# EasyEDA Pro project home-connection.eprj

# Schematic Schematic1
Create Date: 2023-07-15; Page Name: P1; Project Name: home-connection; Schematic Name: Schematic1; Update Date: 2024-01-20; Company: 嘉立创EDA; Page Size: A4; Version: V1.0
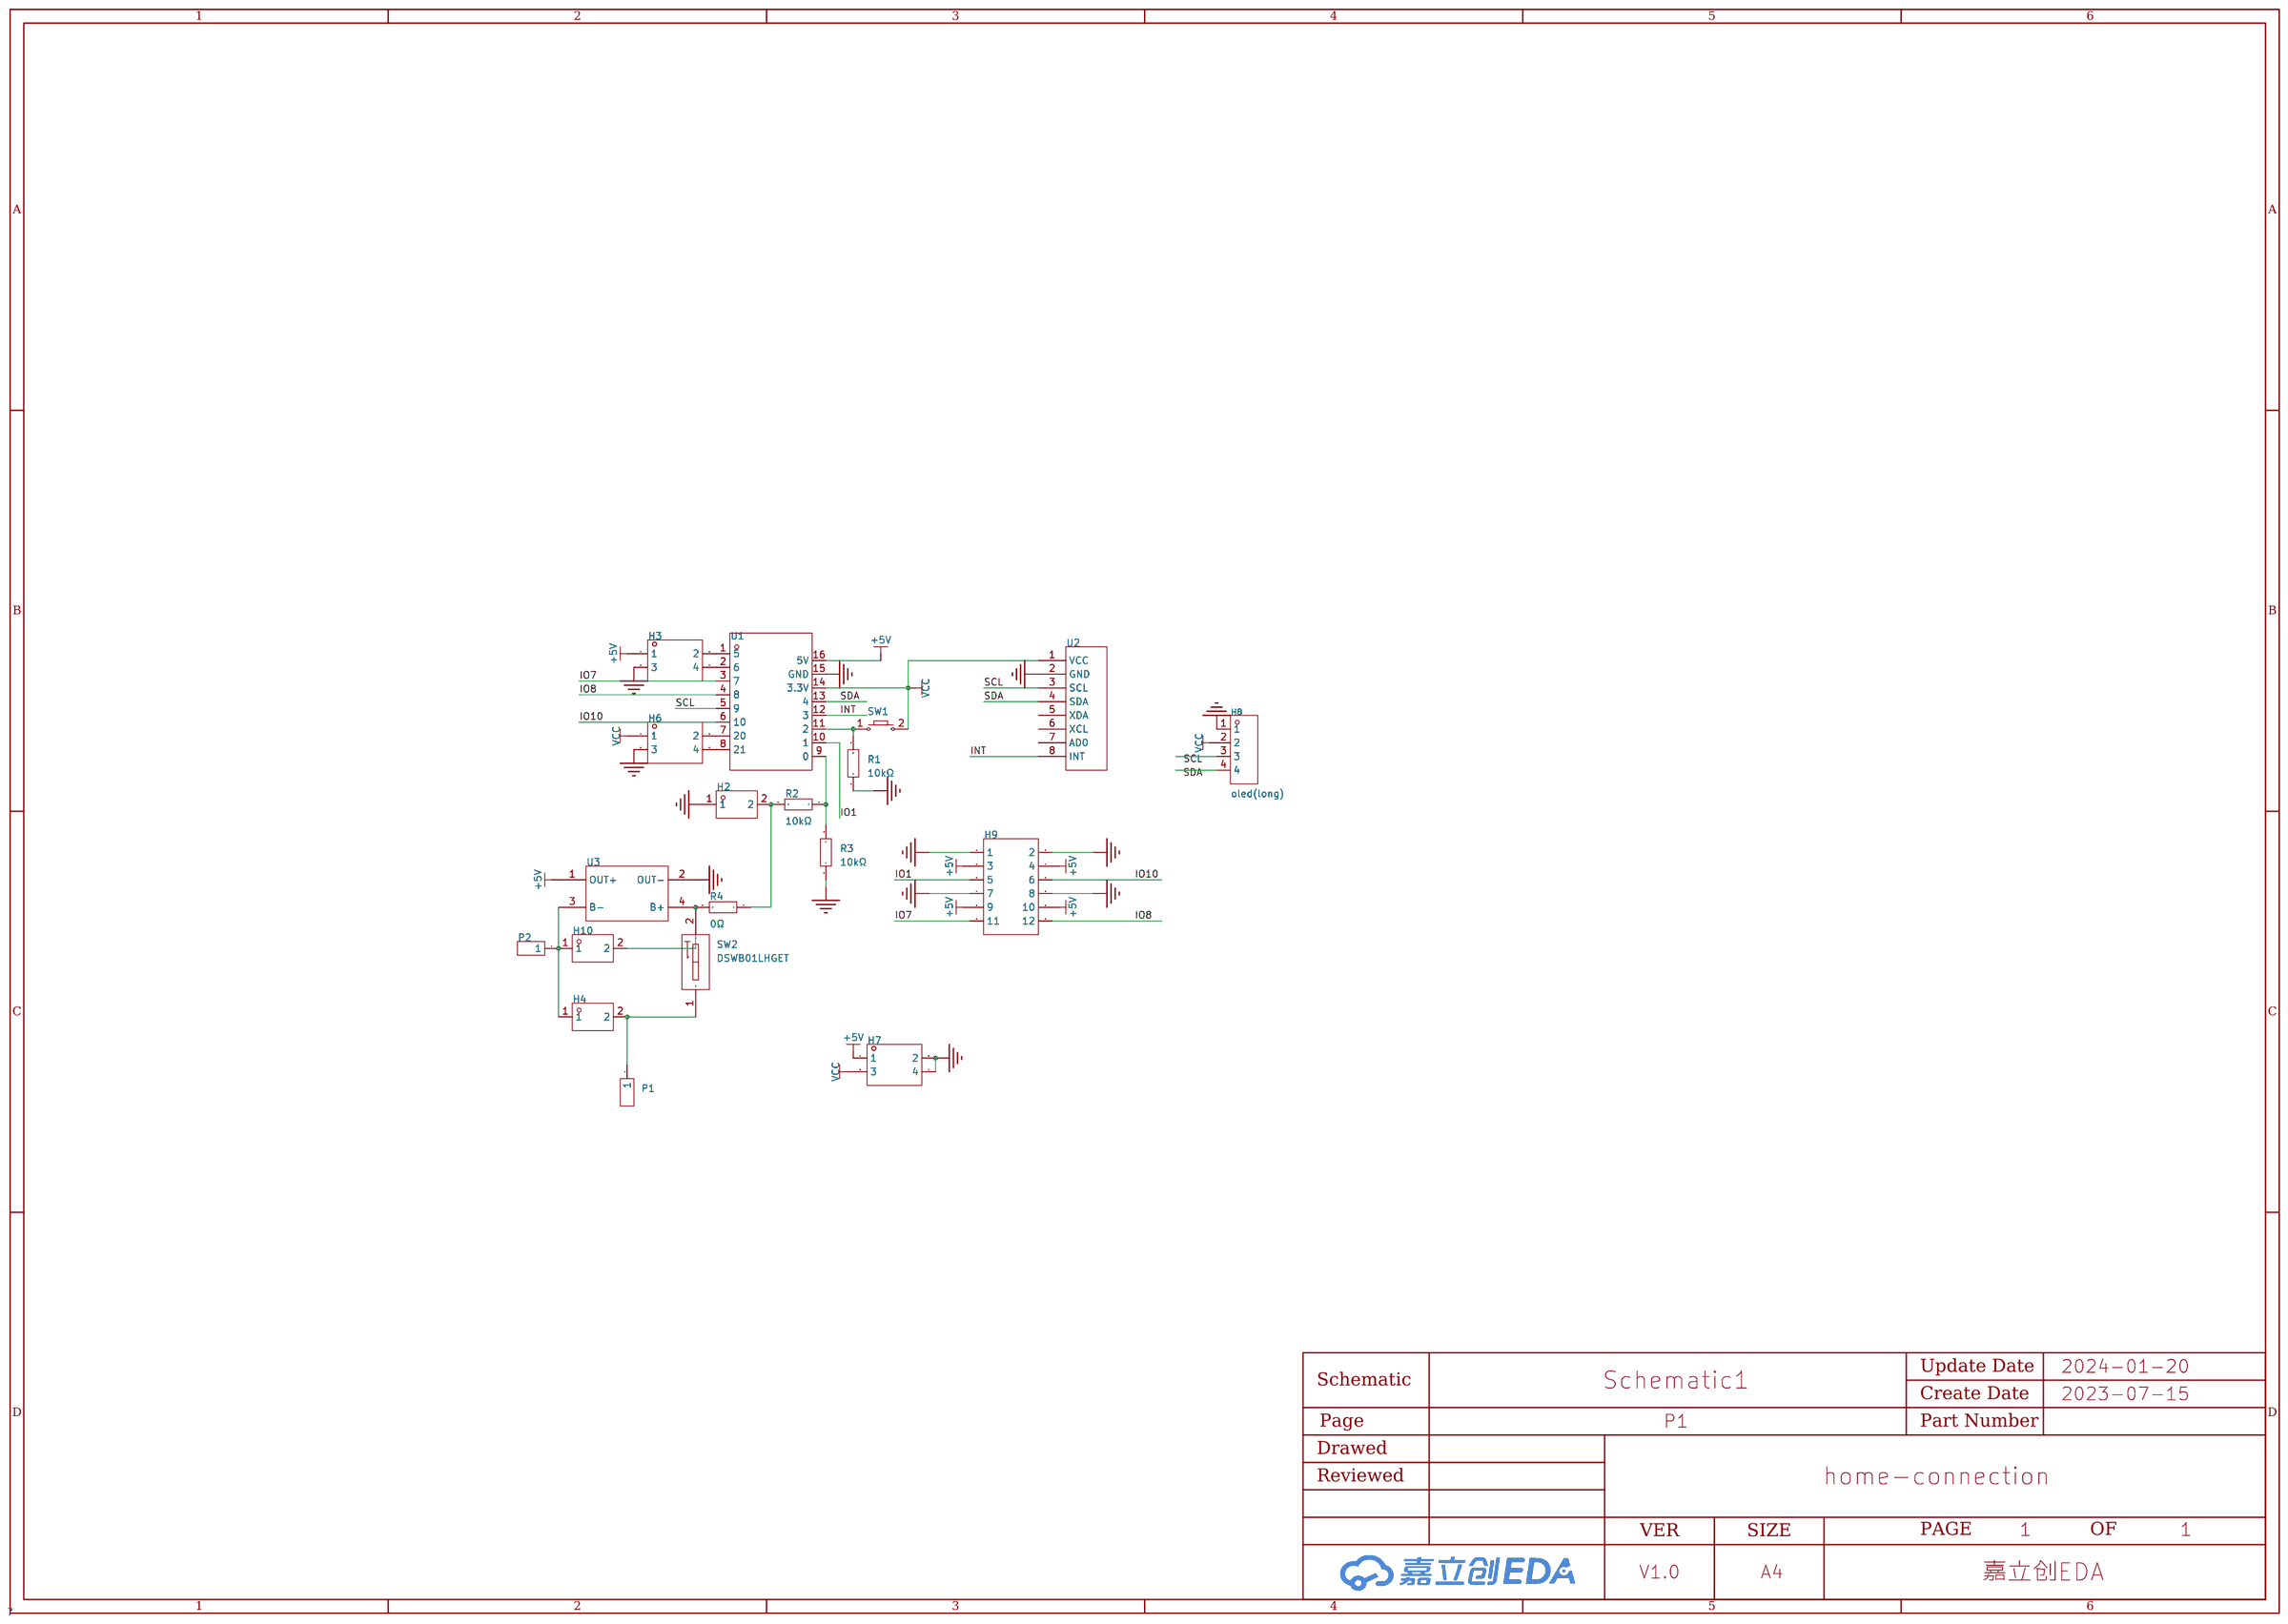
[diagram p0: schematic sheet]

## Parts
H2  -  [HDR-TH_2P-P2.54-V-M-2]
H3  -  [HDR-TH_4P-P2.54-V-F-R2-C2-S2.54]
H4  -  [HDR-TH_2P-P2.54-V-M-2]
H6  -  [HDR-TH_4P-P2.54-V-F-R2-C2-S2.54]
H7  -  [HDR-TH_4P-P2.54-V-F-R2-C2-S2.54]
H8  oled(long)  [HDR-TH_4P-P2.54-V-M]
H9  -  [HDR-TH_12P-P2.54-V-M-R2-C6-S2.54]
H10  -  [HDR-TH_2P-P2.54-V-M-2]
P1  -  [HDR-TH_1P-P2.54-V-M]
P2  -  [HDR-TH_1P-P2.54-V-M]
R1  10kΩ  [R0603]
R2  10kΩ  [R0603]
R3  10kΩ  [R0603]
R4  0Ω  [R0603]
SW1  -  [Key_SMD_3x4x2]
SW2  DSWB01LHGET  [SW-TH_DSWB01LHGET]
U1  2.4GHz  [ESP32-C3-SUPERMINI]
U2  -  [GY-521]
U3  -  [BAT-CHARGE]

## Library data of the parts
H2 H4 H10 = HDR-M_2.54_2x1: Supplier Part: C2883961; Supplier Footprint: 插件,P=2.54mm
H3 H6 H7 = HDR-F_2.54_2x2: Supplier Part: C92273; Supplier Footprint: 插件
H8 = PZ254V-11-04P: 排数:单排;总PIN位数:4;间距:2.54mm;插针结构:1x4P;行距:-;安装类型:直插;圆针/方针:方针;额定电流:3A;额定电压:250V;配合针长度:6mm;塑高:2.5mm;端接针长度:3mm;触头材质:-;工作温度范围:-40℃~+105℃;颜色:黑色;; LCSC Part Name: 2.54mm 1x4P 直插 方针; Supplier Part: C2691448; Manufacturer: XFCN(兴飞); Supplier Footprint: 直插,P=2.54mm; JLCPCB Part Class: Extended Part; Supplier: LCSC; Number of Rows: 单排; Number of Pins: 4; Pitch: 2.54mm; Pin Structure: 1x4P; Mounting Type: 直插; Circluar Pins/Square Pins: 方针; Current Rating (Max): 3A; Voltage Rating (Max): 250V; Length of Mating Pin: 6mm; Insulation Height: 2.5mm; Length of End Connection Pin: 3mm; Operating Temperature Range: -40℃~+105℃; Color: 黑色
H9 = HDR-F_2.54_2x6: Supplier Part: C92270; Supplier Footprint: 插件; JLCPCB Part Class: 扩展库
P1 P2 = 2.54-1*1P针: 间距:-;总PIN位数:1;排数:1;插针结构:-;行距:-;安装类型:直插;圆针/方针:-;额定电流:-;额定电压:-;配合针长度:-;塑高:-;触头材质:-;触头镀层:-;颜色:黑色;; LCSC Part Name: 1x1P; Supplier Part: C81276; Manufacturer: BOOMELE(博穆精密); Supplier Footprint: 插件; JLCPCB Part Class: Extended Part; Supplier: LCSC; Number of Pins: 1; Number of Rows: 1; Mounting Type: 直插; Color: 黑色
R1-R4 = 0603WAF1002T5E: 电阻类型:厚膜电阻;阻值:10kΩ;精度:±1%;功率:100mW;; LCSC Part Name: 厚膜电阻 10kΩ ±1% 100mW; Supplier Part: C25804; Manufacturer: UNI-ROYAL(厚声); Supplier Footprint: 0603; JLCPCB Part Class: Basic Part; Datasheet: https://atta.szlcsc.com/upload/public/pdf/source/20200306/C422600_1E6D84923E4A46A82E41ADD87F860B5C.pdf; Supplier: LCSC; Type: 厚膜电阻; Tolerance: ±1%; Power(Watts): 100mW; Temperature Coefficient: ±100ppm/℃; Overload Voltage (Max): 75V; Operating Temperature Range: -55℃~+155℃
SW1 = Key_SMD_3x4x2: Supplier Footprint: SMD
SW2 = DSWB01LHGET: 类型:平拨,凸起式;电路结构:单刀单掷;开关位数:1;使用寿命:-;颜色:红色;; LCSC Part Name: 红色宽体1位顶拨插件; Supplier Part: C126888; Manufacturer: YE; Supplier Footprint: 插件; JLCPCB Part Class: 扩展库; Datasheet: https://atta.szlcsc.com/upload/public/pdf/source/20170824/C126888_1503565979649906649.pdf; Supplier: LCSC; Type: 平拨,凸起式; Circuit: 单刀单掷; Number of Positions: 1; Color: 红色
U1 = ESP32-C3-SUPERMINI: 核心处理器:ESP32-C3芯片;频率:2.4GHz;发射功率:20.5dBm;; LCSC Part Name: ESP32-C3-WROOM-02U-N4; Supplier Part: C2926676; Manufacturer: ESPRESSIF(乐鑫); Manufacturer Part: ESP32-C3-WROOM-02U-N4; Supplier Footprint: SMD-19P; JLCPCB Part Class: 扩展库; Datasheet: https://atta.szlcsc.com/upload/public/pdf/source/20220106/F07459EFFE1D7CBA94B4FB8A075146A6.pdf; Supplier: LCSC; Core Processor: ESP32-C3芯片; Support Interface: I2C；GPIO；SPI；PWM；JTAG；ADC；UART；USB；I2S; Output Power: 20.5dBm
U2 = GY-521: MPU6050
U3 = BAT-CHARGE: 电池充电模块

## Nets
+5V: H3.1 H7.1 H9.3 H9.4 H9.9 H9.10 U1.16(5V) U3.1(OUT+)
GND: H2.1 H3.3 H6.3 H7.2 H7.4 H8.1 H9.1 H9.2 H9.7 H9.8 R1.1 R3.1 U1.15(GND) U2.2(GND) U3.2(OUT-)
VCC: H6.1 H7.3 H8.2 SW1.2 U1.14(3.3V) U2.1(VCC)
INT: U1.12(3) U2.8(INT)
IO1: H9.5 U1.10(1)
IO7: H9.11 U1.3(7)
IO8: H9.12 U1.4(8)
IO10: H9.6 U1.6(10)
SCL: H8.3 U1.5(9) U2.3(SCL)
SDA: H8.4 U1.13(4) U2.4(SDA)
$1N15091: H3.4 U1.2(6)
$1N15093: H3.2 U1.1(5)
$1N15807: H6.4 U1.8(21)
$1N15809: H6.2 U1.7(20)
$1N16520: H2.2 R2.2 R4.1
$1N16674: R2.1 R3.2 U1.9(0)
$1N16678: H4.2 P1.1 SW2.1(A1)
$1N16682: H4.1 H10.1 P2.1 U3.3(B-)
$1N16689: R1.2 SW1.1 U1.11(2)
$1N17005: H10.2 R4.2 SW2.2 U3.4(B+)

Not connected (* = marked no-connect by the designer): U2 5(XDA) 6(XCL) 7(AD0)

# Board PCB1
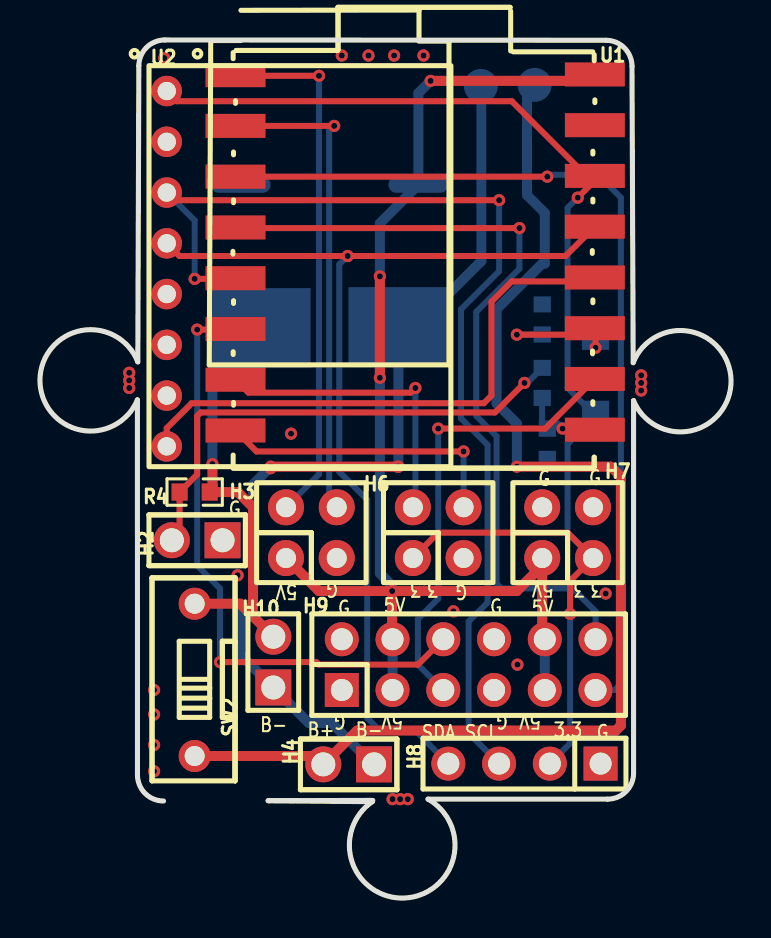
[diagram p1: board, top side]
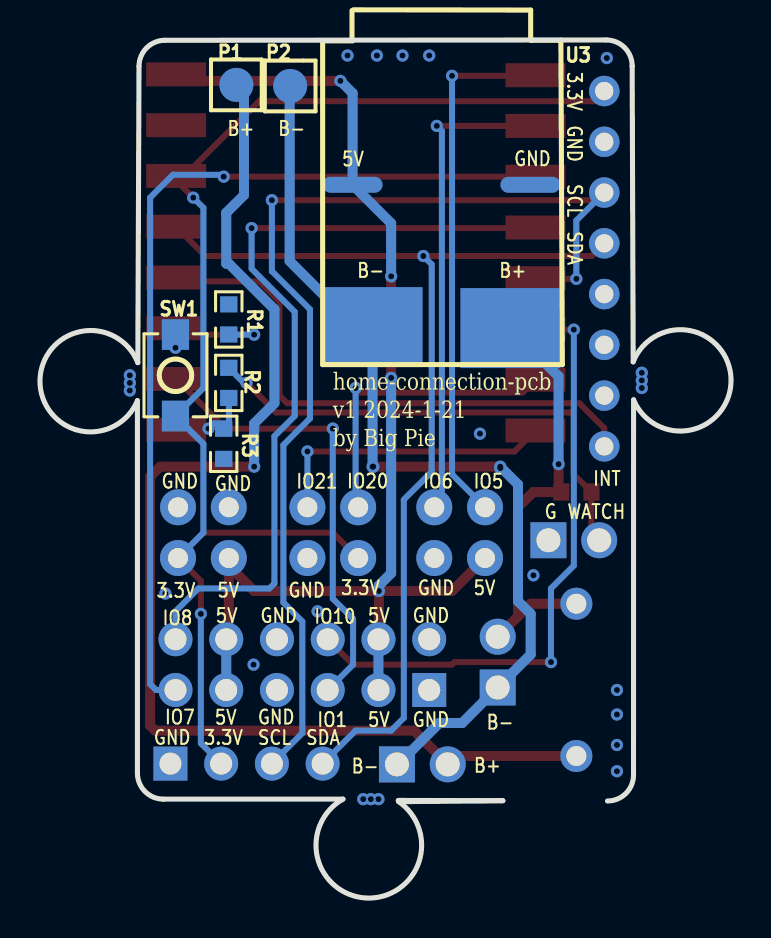
[diagram p2: board, bottom side, seen from below]

Outline 34.59 x 42.94 mm; copper layers: Top Layer, Bottom Layer. Coordinates in mm from the lower left corner of the outline.
Outline path: 6.18,4.86 arc(5.26,5.24) 4.88,6.16 4.88,24.93 arc(0,25.93) 4.9,26.83 4.95,41.64 arc(5.33,42.56) 6.25,42.94 28.34,42.92 arc(29.26,42.54) 29.64,41.62 29.7,26.79 arc(34.59,25.89) 29.71,24.89 29.71,6.25 arc(29.33,5.33) 28.41,4.95 19.43,4.95 arc(18.25,0) 16.63,4.82 11.42,4.87 16.66,4.88
Stack: Top Layer 0.035mm / Dielectric1 1.51mm FR4 er 4.5 / Bottom Layer 0.035mm

## Design rules (mm)
template: 自定义配置
spacing copperThickness1oz (default): track to track 0.102, other pairs 0.152 to 0.3
spacing copperThickness2oz: track to track 0.203, other pairs 0.152 to 0.3
track width copperThickness1oz (default): min 0.127, default 0.254, max 2.54
track width copperThickness2oz: min 0.203, default 0.254, max 2.54
differential pair differentialPair (default): width min 0.127, default 0.254, max 2.54; gap min 0.152, default 0.152
via viaSize (default): diameter min 0.5, default 0.61, max 10; hole min 0.3, default 0.305, max 6.3

## Placement (name value [footprint] x y rotation side)
H2  -  [HDR-TH_2P-P2.54-V-M-2]  7.87 17.9 90 top
H3  -  [HDR-TH_4P-P2.54-V-F-R2-C2-S2.54]  13.59 18.28 0 top
H4  -  [HDR-TH_2P-P2.54-V-M-2]  15.45 6.69 90 top
H6  -  [HDR-TH_4P-P2.54-V-F-R2-C2-S2.54]  19.94 18.28 0 top
H7  -  [HDR-TH_4P-P2.54-V-F-R2-C2-S2.54]  26.41 18.28 0 top
H8  oled(long)  [HDR-TH_4P-P2.54-V-M]  24.25 6.73 180 top
H9  -  [HDR-TH_12P-P2.54-V-M-R2-C6-S2.54]  21.46 11.68 0 top
H10  -  [HDR-TH_2P-P2.54-V-M-2]  11.68 11.81 0 top
P1  -  [HDR-TH_1P-P2.54-V-M]  24.76 40.69 180 bottom
P2  -  [HDR-TH_1P-P2.54-V-M]  22.07 40.64 90 bottom
R1  10kΩ  [R0603]  25.14 28.95 270 bottom
R2  10kΩ  [R0603]  25.14 25.78 90 bottom
R3  10kΩ  [R0603]  25.4 22.73 90 bottom
R4  0Ω  [R0603]  7.74 20.32 0 top
SW1  -  [Key_SMD_3x4x2]  27.81 26.16 270 bottom
SW2  DSWB01LHGET  [SW-TH_DSWB01LHGET]  7.74 10.92 180 top
U1  2.4GHz  [esp32-c3-supermini]  18.79 32.13 0 top
U2  -  [GY-521]  31.11 22.86 0 top
U3  -  [BAT-CHARGE]  20.44 44.19 180 bottom

## Footprints (pads in the part's own frame, mm; a bottom-side part is the same pattern mirrored in y, then rotated)
BAT-CHARGE
  oval 3x0.8 smd: 1(1.5,-8.5) 2(10.398,-8.5)
  rect 5x4 smd: 3(2.5,-15.621) 4(9.398,-15.671)
esp32-c3-supermini
  rect 3x1.2 smd: 1(-9.004,9.05) 2(-9.004,6.51) 3(-9.004,3.97) 4(-9.004,1.43) 5(-9.004,-1.11) 6(-9.004,-3.65) 7(-9.004,-6.19) 8(-9.004,-8.73) 9(8.985,-8.692) 10(8.985,-6.152) 11(8.985,-3.612) 12(8.985,-1.072) 13(8.985,1.468) 14(8.985,4.008) 15(8.985,6.548) 16(8.985,9.088)
GY-521
  round 1.524 hole 0.914: 1(-24.765,17.526) 2(-24.765,14.986) 3(-24.765,12.446) 4(-24.765,9.906) 5(-24.765,7.366) 6(-24.765,4.826) 7(-24.765,2.286) 8(-24.765,-0.254)
HDR-TH_1P-P2.54-V-M
  round 1.7 smd: 1(0,0)
HDR-TH_2P-P2.54-V-M-2
  rect 1.8x1.8 hole 1.2: 1(0,-1.27)
  round 1.8 hole 1.2: 2(0,1.27)
HDR-TH_4P-P2.54-V-F-R2-C2-S2.54
  round 1.8 hole 1: 1(-1.27,-1.27) 2(-1.27,1.27) 3(1.27,-1.27) 4(1.27,1.27)
HDR-TH_4P-P2.54-V-M
  rect 1.7x1.7 hole 1.1: 1(-3.81,0)
  round 1.7 hole 1.1: 2(-1.27,0) 3(1.27,0) 4(3.81,0)
HDR-TH_12P-P2.54-V-M-R2-C6-S2.54
  rect 1.7x1.7 hole 1.1: 1(-6.35,-1.27)
  round 1.7 hole 1.1: 2(-6.35,1.27) 3(-3.81,-1.27) 4(-3.81,1.27) 5(-1.27,-1.27) 6(-1.27,1.27) 7(1.27,-1.27) 8(1.27,1.27) 9(3.81,-1.27) 10(3.81,1.27) 11(6.35,-1.27) 12(6.35,1.27)
Key_SMD_3x4x2
  rect 1.53x1.36 smd: 1(-2.035,0) 2(2.035,0)
R0603
  rect 0.806x0.864 smd: 1(-0.753,0) 2(0.753,0)
SW-TH_DSWB01LHGET
  round 1.6 hole 1: 1(0,3.81) 2(0,-3.81)

## Nets
As in the schematic.

Pads without a net: U2 5 6 7

## Via types
v1: diameter 0.61, hole 0.305, Top Layer to Bottom Layer, 51 vias

## Routing (per net, layer and track width the routed paths; a pad name or vN(x,y) marks a point on that pad's centre or on a via; arc(x,y) is an arc through that point)
+5V: length 60.7
  Top Layer w0.5: H9.4 17.63,12.97 v1(17.63,15.36) ; v1(19.55,40.89) 27.45,40.89 U1.16 ; 12.32,17.01 13.97,15.36 v1(17.63,15.36) ; v1(17.63,15.36) 23.87,15.36 25.14,16.63 ; 25.14,16.63 H7.1 ; 25.14,16.63 25.14,13.08 H9.10 ; v1(17.01,26.03) v1(17.01,31.11)
  Bottom Layer w0.5: H9.4 H9.3 ; v1(17.63,15.36) 17.63,15.64 17.01,16.25 17.01,25.9 ; H9.10 H9.9 ; v1(19.55,40.89) 18.94,40.28 U3.1 17.01,33.76 v1(17.01,31.11)
GND:
  vias: v1(5.71,10.41) v1(5.71,9.18) v1(5.71,7.66) v1(5.71,6.35) v1(6.22,42.03) v1(9.89,16.15) v1(12.57,23.24) v1(15.11,42.16) v1(16.45,42.16) v1(17.73,42.16) v1(19.2,42.16) v1(20.7,14.35) v1(23.9,11.68) v1(28.32,15.24)
VCC: length 65.8
  Top Layer w0.3: v1(26.92,35.05) 27.78,35.9 U1.14 27.36,36.13 23.62,39.87 6.85,39.87 U2.1 ; H6.1 19.94,18.28 26.41,18.28 H7.3 26.54,15.87 v1(26.54,14.22)
  Bottom Layer w0.3: v1(26.54,14.22) 26.54,7.74 H8.2 ; H7.3 26.41,18.28 26.41,22.73 SW1.2 26.41,25.52 26.41,34.54 v1(26.92,35.05)
(no net):
  vias: v1(4.47,26.28) v1(4.47,25.9) v1(4.47,25.52) v1(17.65,4.95) v1(18.03,4.95) v1(18.41,4.95) v1(30.1,26.16) v1(30.1,25.78) v1(30.1,25.4)
INT: length 28.2
  Top Layer w0.3: U2.8 6.35,23.51 7.59,24.76 22.22,24.76 22.6,25.14 22.6,29.84 23.62,30.86 27.58,30.86 U1.12
IO1: length 22.9
  Top Layer w0.3: U1.10 25.29,23.49 v1(19.94,23.49)
  Bottom Layer w0.3: v1(19.94,23.49) 19.94,14.98 18.92,13.97 18.92,11.68 H9.5
IO7: length 45.6
  Top Layer w0.3: U1.3 v1(25.4,36.1)
  Bottom Layer w0.3: v1(25.4,36.1) 25.4,36.19 27.94,36.19 29.08,35.05 29.08,10.71 28.78,10.41 H9.11
IO8: length 40.2
  Top Layer w0.3: U1.4 9.82,33.52 v1(24,33.52)
  Bottom Layer w0.3: v1(24,33.52) 24,31.49 21.84,29.33 21.84,24.13 22.86,23.11 22.86,15.74 23.11,15.49 26.67,15.49 27.81,14.35 H9.12
IO10: length 30.8
  Top Layer w0.3: v1(9.01,11.81) 13.84,11.81 13.97,11.68 18.92,11.68 H9.6 ; 9.79,28.48 9.76,28.44 v1(7.87,28.44)
  Bottom Layer w0.3: v1(9.01,11.81) 9.01,15.49 7.87,16.63 v1(7.87,28.44)
SCL: length 54.3
  Top Layer w0.3: U1.5 9.76,30.98 v1(7.74,30.98) ; U2.3 6.73,34.92 v1(22.98,34.92)
  Bottom Layer w0.3: v1(22.98,34.92) 22.98,31.36 21.08,29.46 21.08,24 22.41,22.67 22.41,14.79 21.46,13.84 21.46,8.25 H8.3 ; v1(7.74,30.98) 7.74,33.9 U2.3
SDA: length 51.2
  Top Layer w0.3: U1.13 26.31,32.13 v1(15.4,32.13) 6.98,32.13 U2.4
  Bottom Layer w0.3: v1(15.4,32.13) 14.98,31.71 14.98,21.33 16.38,19.93 16.38,9.01 17.01,8.38 18.79,8.38 H8.4
$1N15091: length 24.3
  Top Layer w0.3: U1.2 v1(14.73,38.64)
  Bottom Layer w0.3: v1(14.73,38.64) 14.47,38.38 14.47,19.93 H3.4
$1N15093: length 26.6
  Top Layer w0.3: U1.1 9.82,41.14 v1(13.97,41.14)
  Bottom Layer w0.3: 12.32,19.55 13.97,21.2 13.97,41.05 14.09,41.18
$1N15807: length 14.6
  Top Layer w0.3: U1.8 10.84,22.35 v1(21.21,22.35)
  Bottom Layer w0.3: v1(21.21,22.35) H6.4
$1N15809: length 15.4
  Top Layer w0.3: U1.7 10.44,25.29 18.56,25.29 v1(18.79,25.52)
  Bottom Layer w0.3: H6.2 18.79,19.68 v1(18.79,25.52)
$1N16520: length 25
  Top Layer w0.3: v1(24.25,25.78) 22.78,24.3 8.04,24.3 7.87,24.13 7.87,21.2 R4.1 6.99,18.29 H2.2
  Bottom Layer w0.3: R2.2 24.39,25.78 v1(24.25,25.78)
$1N16674: length 4.1
  Top Layer w0.3: v1(26.16,23.49) 26.16,23.62 27.59,23.62 U1.9
  Bottom Layer w0.3: v1(26.16,23.49) 25.9,23.74 25.13,23.74 25.13,24.89
$1N16678: length 61.3
  Top Layer w0.5: v1(23.87,21.59) 28.58,21.59 29.08,21.09 29.08,8.63 28.83,8.38 15.87,8.38 14.18,6.69 13.77,7.11 SW2.1
  Bottom Layer w0.5: P1.1 24.38,40.31 24.38,35.17 25.27,34.29 25.27,31.75 25.14,31.75 22.86,29.46 22.86,24.76 23.87,23.74 v1(23.87,21.59)
$1N16682: length 46.7
  Top Layer w0.5: v1(11.55,21.59) v1(17.94,21.59)
  Bottom Layer w0.5: v1(11.55,21.59) 10.66,20.7 10.66,14.85 10.03,14.22 10.03,12.19 H10.1 13.46,8.76 14.6,8.76 16.67,6.69 H4.1 ; P2.1 22.09,40.61 22.09,31.87 18.79,28.57 U3.3 v1(17.94,21.59)
  vias: v1(11.55,21.51) v1(17.91,21.59)
$1N16689: length 7
  Top Layer w0.3: v1(23.87,28.19) 27.45,28.19 U1.11 27.81,28.48 v1(27.81,27.53)
  Bottom Layer w0.3: 25.13,28.19 25.14,28.19 23.88,28.19 v1(23.87,28.19) ; v1(27.81,27.53) SW1.1
$1N17005: length 21.8
  Top Layer w0.5: v1(8.63,21.71) 8.63,20.45 R4.2 9.9,20.32 10.66,19.55 10.66,14.09 ; 10.66,14.09 10.03,14.73 SW2.2 ; 10.66,14.09 H10.2
  Bottom Layer w0.5: v1(8.63,21.71) 8.63,26.11 U3.4

## Copper pours and planes (outline as drawn; the poured copper is in the pictures)
GND on Top Layer: 5.08,42.67 29.33,42.67 29.33,5.33 5.08,5.33
GND on Bottom Layer: 5.08,42.79 29.33,42.79 29.33,5.46 5.08,5.46
GND on Bottom Layer: 58.29,44.16 72.77,44.16 72.77,13.42 58.29,13.42

## Text on the board
Bottom Silkscreen Layer: INT | WATCH | G | GND | B+ | B- | IO5 | 5V | IO6 | IO20 | 3.3V | IO1 | IO10 | SDA | IO21 | SCL | IO7 | IO8 | home-connection-pcb / v1 2024-1-21 / by Big Pie
Top Silkscreen Layer: 5V | G | 3.3 | B- | B+ | SDA | SCL
